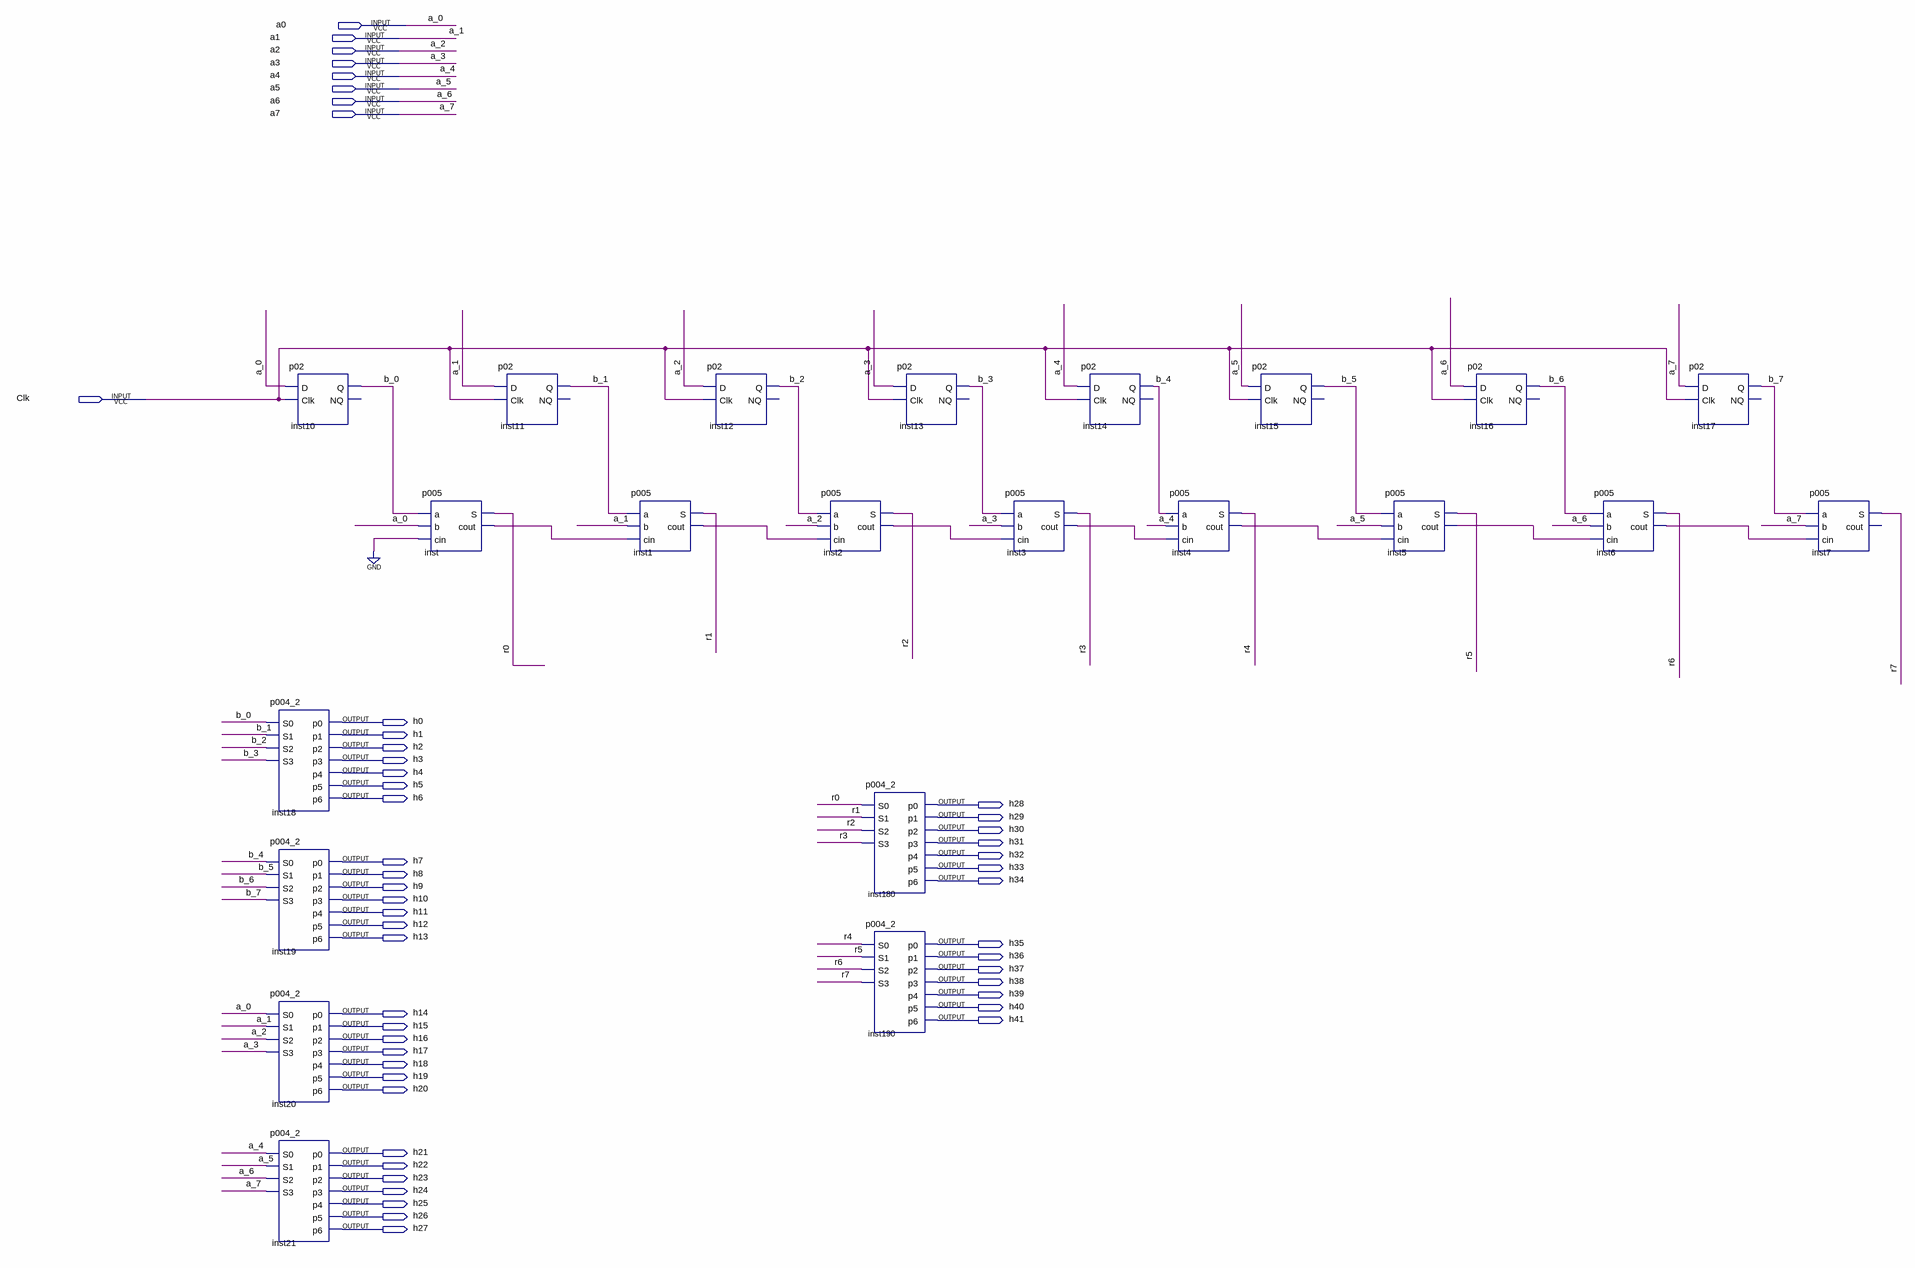
[diagram p0: schematic sheet]
// Quartus schematic p05.bdf as structural Verilog: 22 symbols, 51 pins
module p05 (
  input  a0,
  input  a1,
  input  a2,
  input  a3,
  input  a4,
  input  a5,
  input  a6,
  input  a7,
  input  Clk,
  output h0,
  output h1,
  output h2,
  output h3,
  output h4,
  output h5,
  output h6,
  output h28,
  output h29,
  output h30,
  output h31,
  output h32,
  output h7,
  output h33,
  output h8,
  output h34,
  output h9,
  output h10,
  output h11,
  output h12,
  output h13,
  output h35,
  output h36,
  output h37,
  output h38,
  output h39,
  output h40,
  output h14,
  output h41,
  output h15,
  output h16,
  output h17,
  output h18,
  output h19,
  output h20,
  output h21,
  output h22,
  output h23,
  output h24,
  output h25,
  output h26,
  output h27
);

  wire b_0, b_1, b_2, b_3, b_4, b_5, b_6, b_7, inst1_cout, inst2_cout, inst3_cout, inst4_cout, inst5_cout,
       inst6_cout, inst_cout, r0, r1, r2, r3, r4, r5, r6, r7;

  p02 inst10 (.D(a0), .Clk(Clk), .Q(b_0));  // open: NQ
  p004_2 inst18 (.S0(b_0), .S1(b_1), .S2(b_2), .S3(b_3), .p0(h0), .p1(h1), .p2(h2), .p3(h3), .p4(h4), .p5(h5), .p6(h6));
  p004_2 inst19 (
    .S0(b_4), .S1(b_5), .S2(b_6), .S3(b_7), .p0(h7), .p1(h8), .p2(h9), .p3(h10), .p4(h11), .p5(h12), .p6(h13));
  p004_2 inst20 (
    .S0(a0), .S1(a1), .S2(a2), .S3(a3), .p0(h14), .p1(h15), .p2(h16), .p3(h17), .p4(h18), .p5(h19), .p6(h20));
  p004_2 inst21 (
    .S0(a4), .S1(a5), .S2(a6), .S3(a7), .p0(h21), .p1(h22), .p2(h23), .p3(h24), .p4(h25), .p5(h26), .p6(h27));
  p005 inst (.a(b_0), .b(a0), .cin(1'b0), .S(r0), .cout(inst_cout));
  p02 inst11 (.D(a1), .Clk(Clk), .Q(b_1));  // open: NQ
  p005 inst1 (.a(b_1), .b(a1), .cin(inst_cout), .S(r1), .cout(inst1_cout));
  p02 inst12 (.D(a2), .Clk(Clk), .Q(b_2));  // open: NQ
  p005 inst2 (.a(b_2), .b(a2), .cin(inst1_cout), .S(r2), .cout(inst2_cout));
  p004_2 inst180 (
    .S0(r0), .S1(r1), .S2(r2), .S3(r3), .p0(h28), .p1(h29), .p2(h30), .p3(h31), .p4(h32), .p5(h33), .p6(h34));
  p004_2 inst190 (
    .S0(r4), .S1(r5), .S2(r6), .S3(r7), .p0(h35), .p1(h36), .p2(h37), .p3(h38), .p4(h39), .p5(h40), .p6(h41));
  p02 inst13 (.D(a3), .Clk(Clk), .Q(b_3));  // open: NQ
  p005 inst3 (.a(b_3), .b(a3), .cin(inst2_cout), .S(r3), .cout(inst3_cout));
  p02 inst14 (.D(a4), .Clk(Clk), .Q(b_4));  // open: NQ
  p005 inst4 (.a(b_4), .b(a4), .cin(inst3_cout), .S(r4), .cout(inst4_cout));
  p02 inst15 (.D(a5), .Clk(Clk), .Q(b_5));  // open: NQ
  p005 inst5 (.a(b_5), .b(a5), .cin(inst4_cout), .S(r5), .cout(inst5_cout));
  p02 inst16 (.D(a6), .Clk(Clk), .Q(b_6));  // open: NQ
  p005 inst6 (.a(b_6), .b(a6), .cin(inst5_cout), .S(r6), .cout(inst6_cout));
  p02 inst17 (.D(a7), .Clk(Clk), .Q(b_7));  // open: NQ
  p005 inst7 (.a(b_7), .b(a7), .cin(inst6_cout), .S(r7));  // open: cout

  // Other names for the same wires on the sheet: a_0 = a0; a_1 = a1; a_2 = a2; a_3 = a3; a_4 = a4; a_5 = a5; a_6 = a6;
  //   a_7 = a7
endmodule
